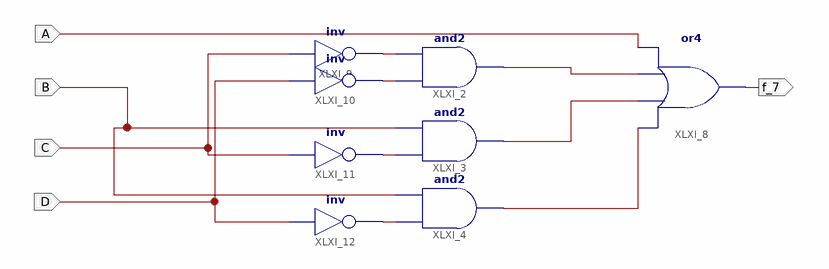
[diagram p0: schematic sheet 1]
// Xilinx ISE schematic f_7.sch (spartan6) as structural Verilog: 8 symbols, 5 ports
module f_7 (
  input  A,
  input  B,
  input  C,
  input  D,
  output f_7
);

  wire XLXN_7, XLXN_8, XLXN_9, XLXN_10, XLXN_18, XLXN_20, XLXN_21;

  and XLXI_2 (XLXN_18, XLXN_8, XLXN_7);
  and XLXI_3 (XLXN_20, XLXN_9, B);
  and XLXI_4 (XLXN_21, XLXN_10, B);
  or XLXI_8 (f_7, XLXN_21, XLXN_20, XLXN_18, A);
  not XLXI_9 (XLXN_7, C);
  not XLXI_10 (XLXN_8, D);
  not XLXI_11 (XLXN_9, C);
  not XLXI_12 (XLXN_10, D);
endmodule
